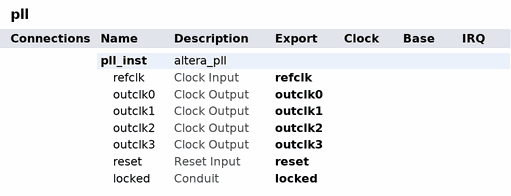
[diagram p0: system contents]
# Platform Designer (Qsys) system pll, Cyclone V 5CSEBA6U23I7
# Parameters at their usual value, and those the tool derives, are not listed.
package require -exact qsys 17.0
create_system pll
set_project_property DEVICE_FAMILY {Cyclone V}
set_project_property DEVICE 5CSEBA6U23I7

add_instance pll_inst altera_pll 17.0
set_instance_parameter_value pll_inst gui_device_speed_grade 7
set_instance_parameter_value pll_inst gui_number_of_clocks 4
set_instance_parameter_value pll_inst gui_operation_mode direct
set_instance_parameter_value pll_inst gui_output_clock_frequency0 114.545454
set_instance_parameter_value pll_inst gui_output_clock_frequency1 57.272727
set_instance_parameter_value pll_inst gui_output_clock_frequency2 114.545454
set_instance_parameter_value pll_inst gui_output_clock_frequency3 28.636363
set_instance_parameter_value pll_inst gui_phase_shift2 4365
set_instance_parameter_value pll_inst gui_pll_mode {Fractional-N PLL}
set_instance_parameter_value pll_inst gui_reference_clock_frequency 50.0
set_instance_parameter_value pll_inst gui_use_locked true

# exported interfaces
add_interface locked conduit end
set_interface_property locked EXPORT_OF pll_inst.locked
add_interface outclk0 clock source
set_interface_property outclk0 EXPORT_OF pll_inst.outclk0
add_interface outclk1 clock source
set_interface_property outclk1 EXPORT_OF pll_inst.outclk1
add_interface outclk2 clock source
set_interface_property outclk2 EXPORT_OF pll_inst.outclk2
add_interface outclk3 clock source
set_interface_property outclk3 EXPORT_OF pll_inst.outclk3
add_interface refclk clock sink
set_interface_property refclk EXPORT_OF pll_inst.refclk
add_interface reset reset sink
set_interface_property reset EXPORT_OF pll_inst.reset

set_interconnect_requirement {$system} qsys_mm.clockCrossingAdapter HANDSHAKE
set_interconnect_requirement {$system} qsys_mm.enableEccProtection FALSE
set_interconnect_requirement {$system} qsys_mm.insertDefaultSlave FALSE
set_interconnect_requirement {$system} qsys_mm.maxAdditionalLatency 1

save_system pll.qsys
